# EAGLE design powerrgulation (EAGLE 8.4.3)
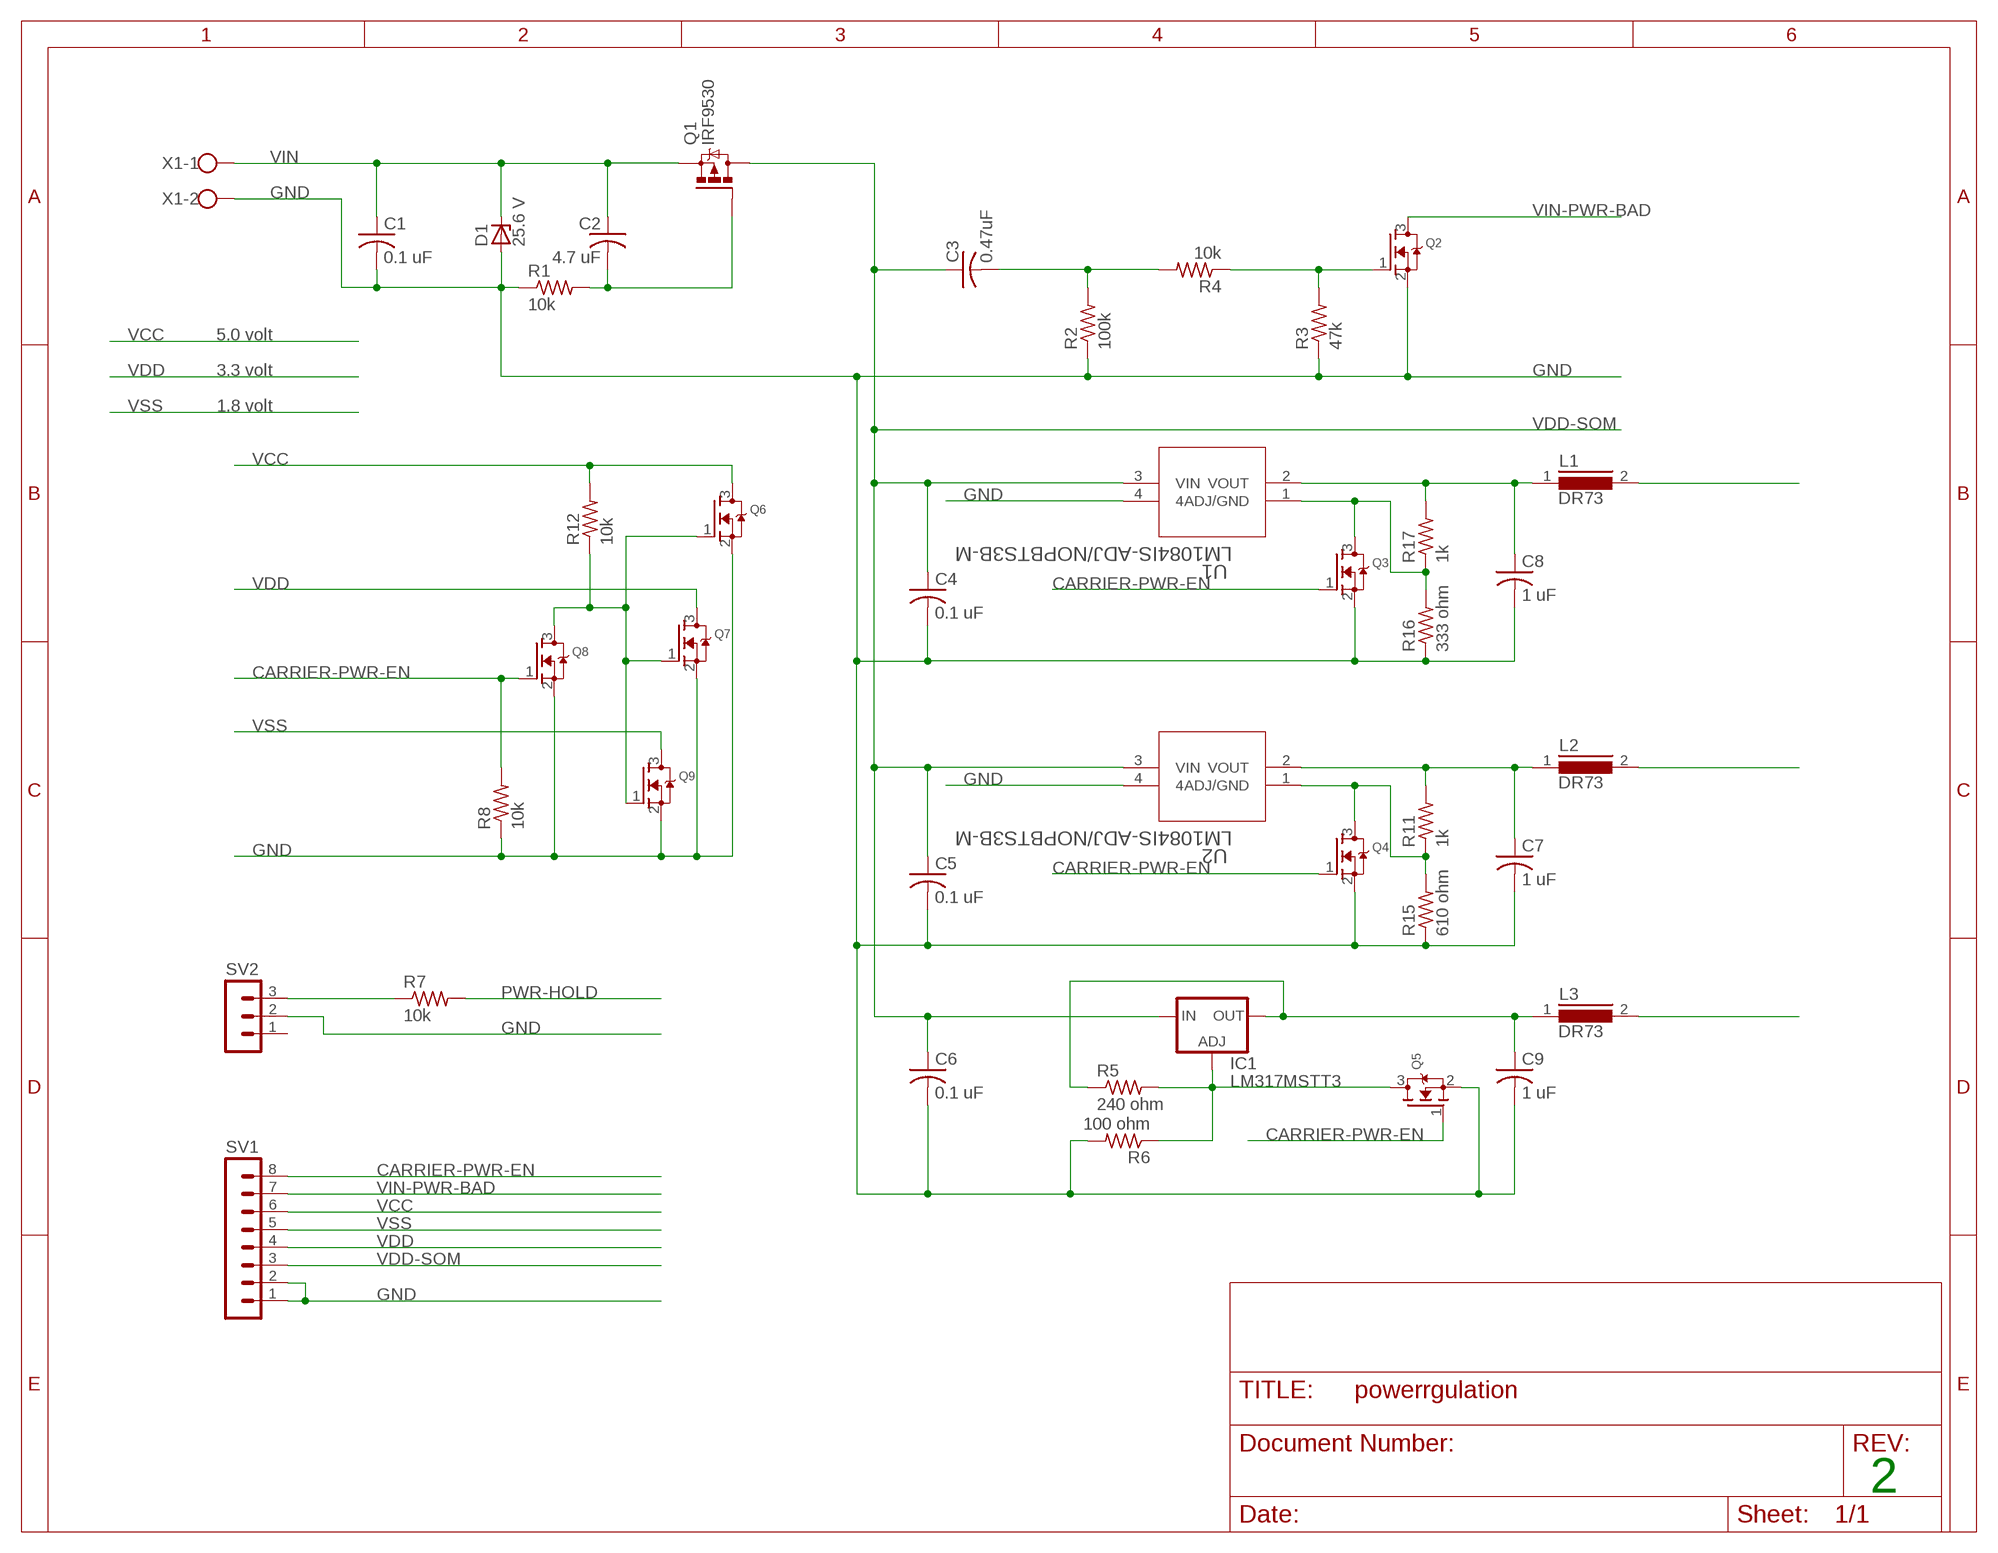
[diagram p0: schematic, sheet 1]

## Parts
C1  0.1 uF  C-USC0805  [C0805]
C2  4.7 uF  C-USC0805  [C0805]
C3  0.47uF  C-USC0805  [C0805]
C4  0.1 uF  C-USC0805  [C0805]
C5  0.1 uF  C-USC0805  [C0805]
C6  0.1 uF  C-USC0805  [C0805]
C7  1 uF  C-USC0805  [C0805]
C8  1 uF  C-USC0805  [C0805]
C9  1 uF  C-USC0805  [C0805]
D1  25.6 V  ZENER-DIODESOT23  [SOT23]
IC1  LM317MSTT3  [SOT223]
L1  DR73  [DR73]
L2  DR73  [DR73]
L3  DR73  [DR73]
Q1  IRF9530  [TO220BV]
Q2  MOSFET-NREFLOW  [SOT23]
Q3  MOSFET-NREFLOW  [SOT23]
Q4  MOSFET-NREFLOW  [SOT23]
Q5  MOSFET-NREFLOW  [SOT23]
Q6  MOSFET-NREFLOW  [SOT23]
Q7  MOSFET-NREFLOW  [SOT23]
Q8  MOSFET-NREFLOW  [SOT23]
Q9  MOSFET-NREFLOW  [SOT23]
R1  10k  R-US_R0603  [R0603]
R2  100k  R-US_R0603  [R0603]
R3  47k  R-US_R0603  [R0603]
R4  10k  R-US_R0603  [R0603]
R5  240 ohm  R-US_R0603  [R0603]
R6  100 ohm  R-US_R0603  [R0603]
R7  10k  R-US_R0603  [R0603]
R8  10k  R-US_R0603  [R0603]
R11  1k  R-US_R0603  [R0603]
R12  10k  R-US_R0603  [R0603]
R15  610 ohm  R-US_R0603  [R0603]
R16  333 ohm  R-US_R0603  [R0603]
R17  1k  R-US_R0603  [R0603]
SV1  MA08-1  [MA08-1]
SV2  MA03-1  [MA03-1]
U1  LM1084IS-ADJ/NOPBTS3B-M  [TS3B-M]
U2  LM1084IS-ADJ/NOPBTS3B-M  [TS3B-M]
X1  W237-102  [W237-102]

## Nets
CARRIER-PWR-EN: Q3.1(G) Q4.1(G) Q5.1(G) Q8.1(G) R8.2 SV1.8
GND: C1.2 C4.2 C5.2 C6.2 C7.2 C8.2 C9.2 D1.1(A) Q2.2(S) Q3.2(S) Q4.2(S) Q5.2(S) Q6.2(S) Q7.2(S) Q8.2(S) Q9.2(S) R1.1 R2.1 R3.1 R6.2 R8.1 R15.1 R16.1 SV1.1 SV1.2 SV2.2 U1.4 U2.4 X1.2
N$1: R7.1 SV2.3
N$2: C3.2 R2.2 R4.2
N$3: Q2.1(G) R3.2 R4.1
N$5: IC1.1(ADJ) Q5.3(D) R5.2 R6.1
N$9: Q3.3(D) R16.2 R17.1 U1.1(ADJ/GND)
N$10: Q4.3(D) R11.1 R15.2 U2.1(ADJ/GND)
PWR-HOLD: C2.2 Q1.G R1.2 R7.2
RAIL-DISCHARGE: Q6.1(G) Q7.1(G) Q8.3(D) Q9.1(G) R12.1
VCC: L1.2 Q6.3(D) R12.2 SV1.6
VCC-VOUT: C8.1 L1.1 R17.2 U1.2(VOUT)
VDD: L2.2 Q7.3(D) SV1.4
VDD-SOM: C3.1 C4.1 C5.1 C6.1 IC1.3(IN) Q1.D SV1.3 U1.3(VIN) U2.3(VIN)
VDD-VOUT: C7.1 L2.1 R11.2 U2.2(VOUT)
VIN: C1.1 C2.1 D1.3(C) Q1.S X1.1
VIN-PWR-BAD: Q2.3(D) SV1.7
VSS: L3.2 Q9.3(D) SV1.5
VSS-VOUT: C9.1 IC1.4(OUT) L3.1 R5.1
Unconnected: SV2.1

## Notes on the sheet
- 5.0 volt
- 3.3 volt
- 1.8 volt
- 2

## Library data of the parts
C1 C2 = resistor:C-US: CAPACITOR, American symbol
C3 = adafruit:C-US: CAPACITOR, American symbol
C4-C9 = rcl:C-US: CAPACITOR, American symbol
D1 = diode:ZENER-DIODE: Z-Diode
IC1 = v-reg:LM317?*: 500 mA Adjustable Output Positive Voltage Regulator Source: http://www.onsemi.co.jp .. LM317M-D.PDF
L1-L3 = inductors:DR73: High Power Density, High Efficiency, Shielded Inductors Source: coiltronics_dr_series.pdf; SPICEPREFIX: L
Q1 = transistor-power:IRF9530: P-CHANNEL HEXFET POWER-MOS-FET Source: http://www.irf.com/product-info/datasheets/data/irf9530.pdf
Q2-Q9 = adafruit:MOSFET-N: N-Channel Mosfet 2N7002E - 60V 260mA SOT23 [Digikey: 2N7002ET1GOSTR-ND] - REEL BSH103 - 30V 850mA SOT23 [Digikey: 568-5013-1-ND]
R1 R5-R7 = rcl:R-US_: RESISTOR, American symbol; SPICEPREFIX: R
R2-R4 = adafruit:R-US_: RESISTOR, American symbol
R8 R11 R12 R15-R17 = resistor:R-US_: RESISTOR, American symbol
SV1 = con-lstb:MA08-1: PIN HEADER; OC_FARNELL: unknown; OC_NEWARK: unknown
SV2 = con-lstb:MA03-1: PIN HEADER; OC_FARNELL: unknown; OC_NEWARK: unknown
U1 U2 = JetsonProj:LM1084IS-ADJ/NOPB; MANUFACTURER_PART_NUMBER: LM1084ISADJNOPB; VENDOR: Texas Instruments
X1 = con-wago-500:W237-102: WAGO SCREW CLAMP; MPN: 237-102; OC_FARNELL: unknown; OC_NEWARK: 70K9898

## Net classes
0 default: clearance 0.205 mm

## Board
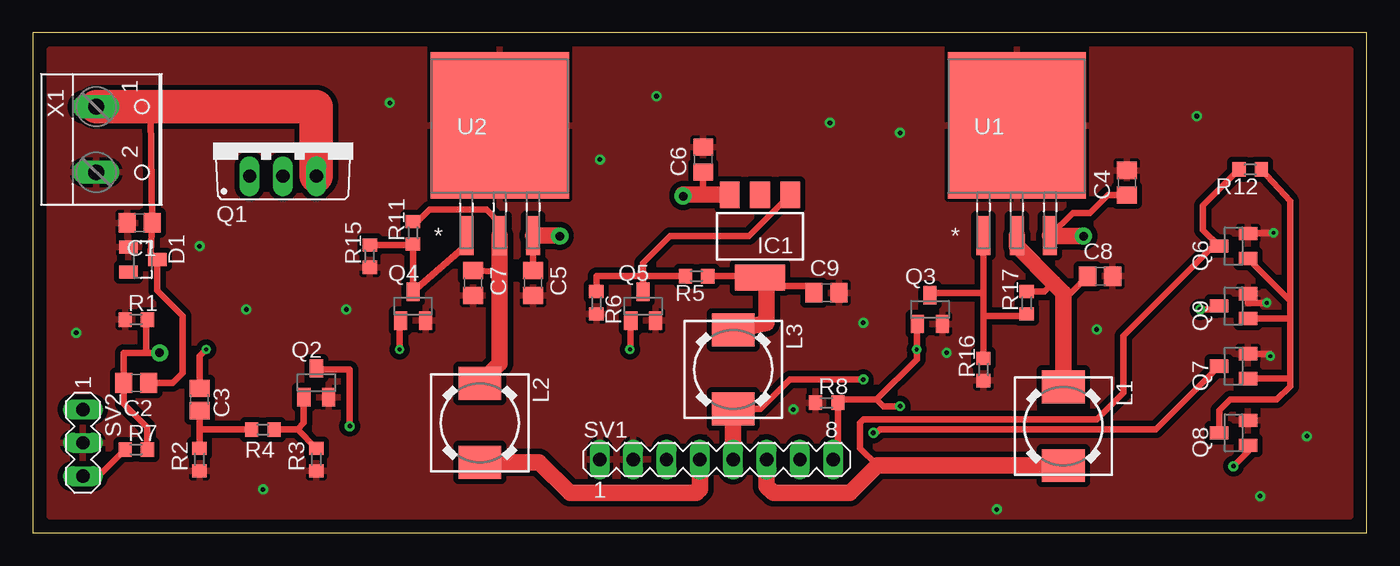
[diagram p1: board, top side]
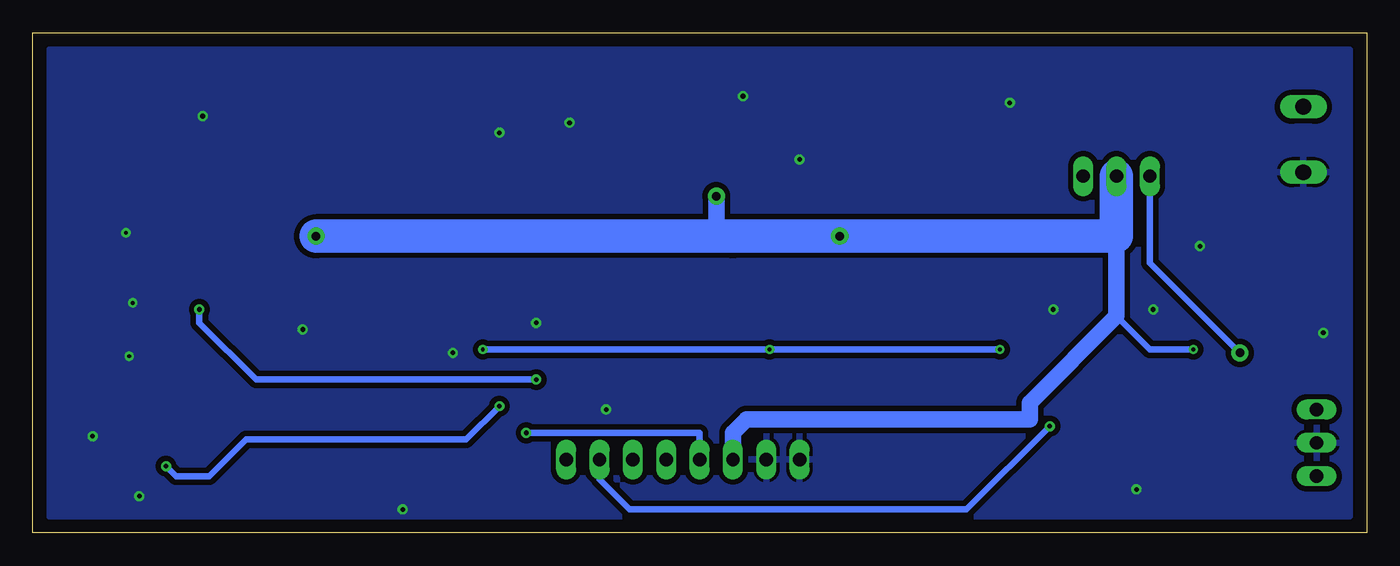
[diagram p2: board, bottom side, seen from below]

Size 101.58 x 38.1 mm. Coordinates in mm from the lower left corner, seen from the top.
Outline: 0,0 101.58,0 101.58,38.1 0,38.1 0,0
Copper layers (1*16): Top 0.035mm / dielectric 1.5mm / Bottom 0.035mm
Design rules "default": minimum track width 6mil, minimum drill 0.35mm, track to track 6mil, track to pad 6mil, pad to pad 6mil, via to via 6mil, smd to smd 6mil, copper to edge 40mil, drill to drill 6mil, minimum pad ring 10mil, minimum via ring 8mil, stop-mask expansion 4mil, vias tented up to drill 0mil, thermal gap 10mil

### Footprints (pad centres in the part's own frame; a part is rotated, then mirrored left to right if it is on the bottom)
C0805 = smd 1.3 x 1.5: 1 -0.95,0; 2 0.95,0
C0805' = smd 1.3 x 1.5: 1 -0.85,0; 2 0.85,0
SOT23 = smd 1 x 1.4: 1 -0.95,-1.1; 2 0.95,-1.1; 3 0,1.1
SOT223 = smd 1.5 x 2: 1 -2.3,-3.15; 2 0,-3.15; 3 2.3,-3.15 | smd 3.8 x 2: 4 0,3.15
DR73 = smd 2.5 x 3.25: 1 -3,0; 2 3,0
TO220BV = drill 1.016 long: D 0,-2.54; G -2.54,-2.54; S 2.54,-2.54
R0603 = smd 1 x 1.1: 1 -0.85,0; 2 0.85,0
MA08-1 = drill 1.016 long: 1 -8.89,0; 2 -6.35,0; 3 -3.81,0; 4 -1.27,0; 5 1.27,0; 6 3.81,0; 7 6.35,0; 8 8.89,0
MA03-1 = drill 1.016 long: 1 -2.54,0; 2 0,0; 3 2.54,0
TS3B-M = smd 1.067 x 2.997: 1 -2.54,-8.331; 2 0,-8.331; 3 2.54,-8.331 | smd 10.516 x 11.176: 4 0,0.051
W237-102 = drill 1.194 long: 1 -2.5,-1.27; 2 2.5,-1.27

### Placement (x,y rotation side)
C1  8.13,23.62 180 top
C2  7.87,11.43 180 top
C3  0.47uF  [C0805']  12.7,10.16 270 top
C4  83.31,26.67 90 top
C5  38.1,19.05 270 top
C6  51.05,28.45 90 top
C7  33.53,19.05 270 top
C8  81.28,19.56 0 top
C9  60.45,18.29 0 top
D1  8.38,20.83 270 top
IC1  55.37,22.61 180 top
L1  78.49,8.13 270 top
L2  34.04,8.38 270 top
L3  53.34,12.45 270 top
Q1  19.05,29.72 0 top
Q2  21.59,11.43 0 top
Q3  68.33,17.02 0 top
Q4  28.96,17.27 0 top
Q5  46.48,17.27 0 top
Q6  91.44,21.84 90 top
Q7  91.44,12.7 90 top
Q8  91.44,7.62 90 top
Q9  91.44,17.27 90 top
R1  7.87,16.26 0 top
R2  12.7,5.59 90 top
R3  21.59,5.59 90 top
R4  17.53,7.87 180 top
R5  50.55,19.56 180 top
R6  42.93,17.53 270 top
R7  7.87,6.35 0 top
R8  60.45,9.91 0 top
R11  28.96,22.86 90 top
R12  92.71,27.69 180 top
R15  25.65,21.08 90 top
R16  72.39,12.45 90 top
R17  75.69,17.53 90 top
SV1  52.07,5.59 0 top
SV2  3.81,6.86 270 top
U1  74.93,30.99 0 top
U2  35.56,30.99 0 top
X1  6.1,29.97 270 top

### Tracks (layer width: path | path; a pad name or v marks a point on that pad's centre or on a via)
CARRIER-PWR-EN  (via drill 0.3, 0.35)
  Top 0.508: 67.31,15.85 Q3.1 67.31,15.92 v67.31,13.97 67.31,13.21 64.26,10.16 | Q4.1 27.94,16.11 v27.94,13.97 | Q5.1 45.53,14.04 v45.47,13.97 | 64.26,10.16 61.56,10.16 R8.2 61.3,5.93 SV1.8 | 64.26,10.16 64.77,9.65 v66.04,9.65 | v91.44,5.08 92.54,6.18 Q8.1
  Bottom 0.508: v27.94,13.97 v45.47,13.97 v67.31,13.97 | v66.04,9.65 68.58,7.11 85.34,7.11 88.14,4.32 90.68,4.32 v91.44,5.08
GND  (via drill 0.3, 0.35)
  Top 0.508: Q6.2 92.54,22.86 v94.49,22.86 | Q7.2 94.23,13.65 v94.23,13.46 | Q9.2 92.54,17.53 v93.98,17.53
  other vias: 63.25,16 57.91,9.4 27.18,32.77 60.71,31.24 88.65,31.75 81.03,15.49 69.6,13.72 23.88,17.02 17.53,3.3 16.26,17.02 12.7,21.84 3.3,15.24 43.18,28.45 47.5,33.27 66.04,30.48 97.03,7.37 93.47,2.79 73.41,1.78
  pour Top (isolate 0.406): 1.27,36.83 1.27,1.27 100.33,1.27 100.33,36.83
  pour Bottom (isolate 0.406): 1.27,36.83 1.27,1.27 100.33,1.27 100.33,36.83
N$1
  Top 0.508: R7.1 4.99,4.32 SV2.3
N$2
  Top 0.508: 12.7,7.87 R2.2 | 12.7,7.87 C3.2 | R4.2 12.7,7.87
N$3
  Top 0.508: 20.15,7.87 R4.1 | 20.15,7.87 R3.2 | Q2.1 20.64,8.36 20.15,7.87
N$5
  Top 0.508: IC1.1 56.53,24.61 56.53,24.59 54.55,22.61 48.51,22.61 46.48,20.57 46.48,19.56 | Q5.3 46.48,19.56 | 46.48,19.56 R5.2 | R6.1 42.93,19.56 46.48,19.56
N$9
  Top 0.508: 72.39,18.29 72.39,16.51 | 72.39,18.29 U1.1 | 72.39,16.51 R16.2 | R17.1 75.69,16.51 72.39,16.51 | Q3.3 68.33,18.29 72.39,18.29
N$10
  Top 0.508: U2.1 33.02,21.93 Q4.3 R11.1 28.96,21.93 R15.2
PWR-HOLD  (via drill 0.65 pad 1.3)
  Top 0.508: 8.64,13.72 6.92,13.72 C2.2 6.92,9.84 8.72,8.04 R7.2 | 8.64,13.72 8.64,16.26 R1.2 | 8.64,13.72 v9.65,13.72
  Bottom 0.508: v9.65,13.72 16.51,20.57 Q1.G
RAIL-DISCHARGE
  Top 0.508: 95.76,11.75 Q7.1 | 95.76,16.26 95.76,11.75 | 95.76,17.68 95.76,16.26 | 95.76,17.68 Q6.1 | Q9.1 95.69,16.32 95.76,16.26 | R12.1 95.76,25.29 95.76,17.68 | 95.76,11.75 95.76,11.18 94.74,10.16 91.19,10.16 90.34,9.31 Q8.3
VCC
  Top 0.508: R12.2 89.11,24.94 89.11,23.07 Q6.3 89.92,21.84 83.06,14.99 83.06,10.67 81.03,8.64 63.25,8.64 62.99,8.38 62.99,6.45 64.31,5.13
  Top 1.27: L1.2 64.31,5.13 62.23,3.05 56.39,3.05 55.88,3.56 SV1.6
VCC-VOUT
  Top 0.508: R17.2 77.05,18.38 77.72,19.05 | C8.1 79.06,18.29 78.49,18.29
  Top 1.27: U1.2 74.93,21.84 77.72,19.05 78.49,18.29 L1.1
VDD  (via drill 0.35)
  Top 0.508: Q7.3 85.51,7.87 64.52,7.87 64.26,7.62 v64.01,7.62
  Top 1.27: L2.2 38.56,5.38 40.89,3.05 50.55,3.05 50.8,3.3 SV1.4
  Bottom 0.508: v64.01,7.62 50.8,7.62 SV1.4
VDD-SOM  (via drill 0.3, 0.65 pad 1.3)
  Top 0.508: v13.21,13.97 12.7,13.46 C3.1 | C5.1 U2.3 | C6.1 51.05,25.76 51.56,25.76 | U1.3 79.2,24.38 80.52,24.38 81.85,25.72 C4.1
  Top 1.27: v49.53,25.65 49.53,25.76 51.56,25.76 IC1.3 | U2.3 40.13,22.66 v40.13,22.61 | U1.3 77.52,22.61 v80.01,22.61
  Bottom 0.508: 19.05,22.61 19.05,21.59 | v13.21,13.97 16.51,13.97 19.05,16.51
  Bottom 1.27: 19.05,22.61 v40.13,22.61 48.26,22.61 49.53,22.61 | 49.53,22.61 v80.01,22.61 | 80.26,22.61 v80.01,22.61 | 49.53,22.61 v49.53,25.65 | v80.01,22.61 80.26,22.86 | Q1.D 19.05,21.59 19.05,16.51 25.65,9.91 25.65,8.64 47.24,8.64 48.26,7.62 SV1.3
  Bottom 2.54: Q1.D 19.05,22.61 48.26,22.61 v80.01,22.61
VDD-VOUT
  Top 0.508: 29.15,23.71 R11.2 29.3,23.71 30.23,24.64 34.54,24.64 35.56,23.62 U2.2 | C7.1 35.39,19.9 35.56,20.07
  Top 1.27: U2.2 35.56,20.07 35.56,12.91 L2.1
VIN
  Top 0.508: X1.1 8.98,31.88 C1.1 8.98,21.33 D1.3 9.48,18.46 11.43,16.51 11.43,12.19 10.67,11.43 C2.1
  Top 2.54: X1.1 21.59,32.47 Q1.S
VIN-PWR-BAD  (via drill 0.35)
  Top 0.508: Q2.3 21.67,12.45 24.13,12.45 v24.13,8.13
  Bottom 0.508: v24.13,8.13 30.48,1.78 56.13,1.78 58.42,4.06 SV1.7
VSS  (via drill 0.35)
  Top 0.508: L3.2 55.42,9.45 57.66,11.68 v63.25,11.68 | v88.9,17.02 90.09,17.02 Q9.3
  Top 1.27: SV1.5 L3.2
  Bottom 0.508: v63.25,11.68 84.58,11.68 88.9,16 v88.9,17.02
VSS-VOUT
  Top 0.508: R5.1 55.12,19.56 55.37,19.56 IC1.4 | C9.1 58.99,18.8 55.88,18.8
  Top 1.27: L3.1 55.88,16 55.88,18.8 55.12,19.56